# Altium schematic sheet Powersupply.SchDoc: 48v to 4v, 260mA
size A4; Organization: Altium Limited; Address1: L3, 12a Rodborough Rd; Address2: Frenchs Forest; Address3: NSW; Address4: Australia 2086; DocumentNumber: 1; Revision: 0; SheetNumber: 1; SheetTotal: 1
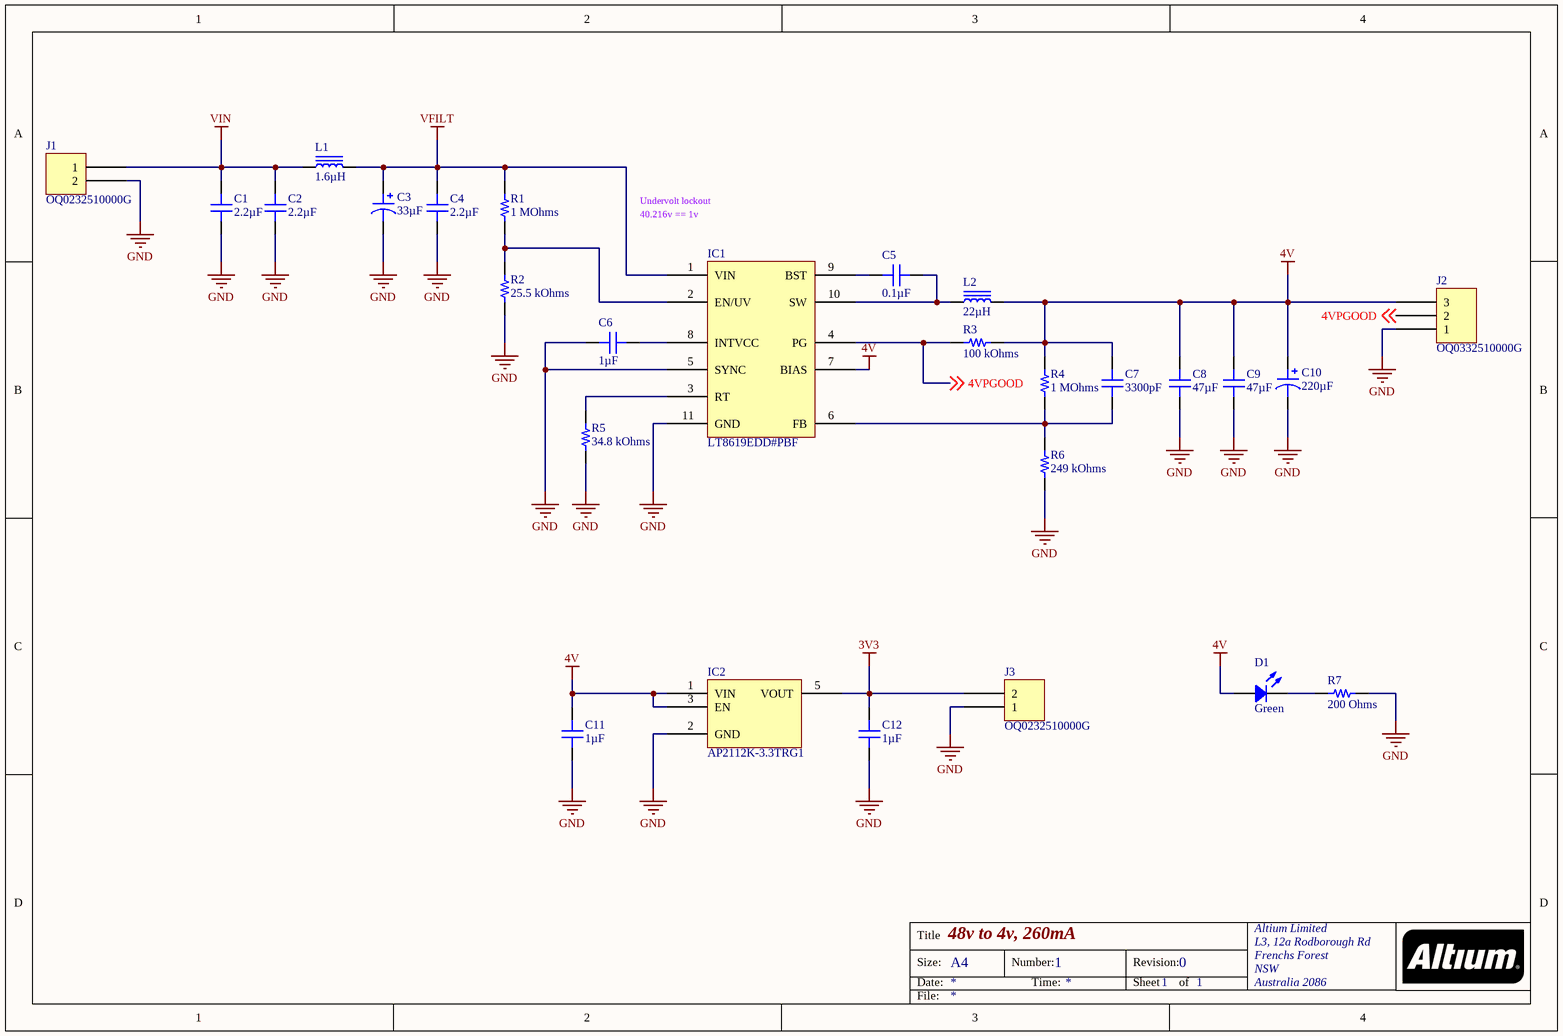
[diagram p0: Powersupply.SchDoc]

## Parts
C1  2.2µF  [CAP 1206_3216 - 1.8MM]
C2  2.2µF  [CAP 1206_3216 - 1.8MM]
C3  33µF  [CAP ALSMD 8.3MM H10.5MM]
C4  2.2µF  [CAP 1206_3216 - 1.8MM]
C5  0.1µF  [CAP 0603_1608]
C6  1µF  [CAP 0402_1005]
C7  3300pF  [CAP 0402_1005]
C8  47µF  [CAP 1206_3216 - 1.8MM]
C9  47µF  [CAP 1206_3216 - 1.8MM]
C10  220µF  [CAP ALSMD POLY 8.3MM H6.7MM]
C11  1µF  [CAP 0402_1005]
C12  1µF  [CAP 0402_1005]
D1  Green  [LED 0603_1608 GREEN]
IC1  LT8619EDD#PBF  [ANALOG DFN-10 3x3MM DD]
IC2  AP2112K-3.3TRG1  [DIODES SOT-23-5 W5]
J1  OQ0232510000G  [FCI 06-381-2PIN]
J2  OQ0332510000G  [FCI 06-381-3PIN]
J3  OQ0232510000G  [FCI 06-381-2PIN]
L1  1.6µH  [TDK VLCF4024-2]
L2  22µH  [TDK SLF12555]
R1  1 MOhms  [RES 0402_1005]
R2  25.5 kOhms  [RES 0402_1005]
R3  100 kOhms  [RES 0402_1005]
R4  1 MOhms  [RES 0402_1005]
R5  34.8 kOhms  [RES 0402_1005]
R6  249 kOhms  [RES 0402_1005]
R7  200 Ohms  [RES 0603_1608]

## Nets
3V3: C12.1 IC2.5(VOUT) J3.2
4V: C7.2 C8.2 C9.2 C10.1 C11.1 D1.1 IC1.7(BIAS) IC2.1(VIN) IC2.3(EN) J2.3 L2.2 R3.2 R4.2
GND: C1.1 C2.1 C3.2 C4.1 C6.2 C8.1 C9.1 C10.2 C11.2 C12.2 IC1.5(SYNC) IC1.11(GND) IC2.2(GND) J1.2 J2.1 J3.1 R2.1 R5.1 R6.1 R7.2
VFILT: C3.1 C4.2 IC1.1(VIN) L1.2 R1.2
VIN: C1.2 C2.2 J1.1 L1.1
4VPGOOD: IC1.4(PG) J2.2 R3.1 ; off-sheet 4VPGOOD
NetC5_1: C5.1 IC1.9(BST)
NetC5_2: C5.2 IC1.10(SW) L2.1
NetC6_1: C6.1 IC1.8(INTVCC)
NetC7_1: C7.1 IC1.6(FB) R4.1 R6.2
NetD1_2: D1.2 R7.1
NetIC1_2: IC1.2(EN/UV) R1.1 R2.2
NetIC1_3: IC1.3(RT) R5.2

## Notes on the sheet
- 40.216v == 1v
- Undervolt lockout
- Title
- Size:
- Date:
- A4
- Number:
- Time:
- Revision:
- Sheet
- of
- File:

## Library data of the parts
C1 C2 C4 = 12061C225KAT2A: CAP CER 2.2UF 100V X7R 1206; Manufacturer: AVX Corporation; Tolerance: ±10%; Part Number: 12061C225KAT2A; Value: 2.2µF; Applications: General Purpose; Capacitance: 2.2µF; ComponentLink1Description: Datasheet; ComponentLink1URL: http://datasheets.avx.com/X7RDielectric.pdf; ComponentLink2Description: DigiKey Link; ComponentLink2URL: //digikey.com/product-detail/en/avx-corporation/12061C225KAT2A/478-10860-2-ND/3081499; Device Package: 1206 (3216 Metric); LastUpdated: 29/11/2019 21:36:25; Lifecycle Status: 0; Minimum Order: 1; Mounting Type: Surface Mount, MLCC; Operating Temperature: -55°C ~ 125°C; Package / Case: 1206 (3216 Metric); Packaging: TapeAndReel; PartId: 22821; Part Status: Active; Price: 0.13; Series: -; Size / Dimension: 0.126" L x 0.063" W (3.20mm x 1.60mm); Supplier 1: DigiKey; Supplier Part Number 1: 478-10860-2-ND; Temperature Coefficient: X7R; Thickness (Max): 0.071" (1.80mm); Voltage - Rated: 100V
C3 = EEH-ZA1J330P: CAP ALUM POLY HYB 33UF 63V SMD; Manufacturer: Panasonic Electronic Components; ESR (Equivalent Series Resistance): 40mOhm; Lifetime @ Temp.: 10000 Hrs @ 105°C; Ripple Current @ High Frequency: 1.7A @ 100kHz; Ripple Current @ Low Frequency: 170mA @ 100Hz; Surface Mount Land Size: 0.327" L x 0.327" W (8.30mm x 8.30mm); Tolerance: ±20%; Type: Hybrid; Part Number: EEH-ZA1J330P; Applications: Automotive; Capacitance: 33µF; ComponentLink1Description: Datasheet; ComponentLink1URL: https://industrial.panasonic.com/cdbs/www-data/pdf/RDD0000/ABA0000C1221.pdf; ComponentLink2Description: DigiKey Link; ComponentLink2URL: //digikey.com/product-detail/en/panasonic-electronic-components/EEH-ZA1J330P/P15448TR-ND/3088131; Device Package: Radial, Can - SMD; Height - Seated (Max): 0.413" (10.50mm); LastUpdated: 22/12/2019 06:14:41; Lifecycle Status: 0; Minimum Order: 1; Mounting Type: Surface Mount; Operating Temperature: -55°C ~ 105°C; Package / Case: Radial, Can - SMD; Packaging: TapeAndReel; PartId: 2088; Part Status: Active; Price: 1.05; Ratings: AEC-Q200; Series: ZA; Size / Dimension: 0.315" Dia (8.00mm); Supplier 1: DigiKey; Supplier Part Number 1: P15448TR-ND; Value: 33µF; Voltage - Rated: 63V
C5 = HMK107B7104MA-T: CAP CER 0.1UF 100V X7R 0603; Manufacturer: Taiyo Yuden; Tolerance: ±20%; Part Number: HMK107B7104MA-T; Value: 0.1µF; Applications: General Purpose; Capacitance: 0.1µF; ComponentLink1Description: Datasheet; ComponentLink1URL: https://ds.yuden.co.jp/TYCOMPAS/ut/detail?pn=HMK107B7104MA-T &u=M; ComponentLink2Description: DigiKey Link; ComponentLink2URL: //digikey.com/product-detail/en/taiyo-yuden/HMK107B7104MA-T/587-6323-2-ND/5810933; Device Package: 0603 (1608 Metric); Features: High Voltage; LastUpdated: 29/11/2019 20:59:48; Lifecycle Status: 0; Minimum Order: 1; Mounting Type: Surface Mount, MLCC; Operating Temperature: -55°C ~ 125°C; Package / Case: 0603 (1608 Metric); Packaging: TapeAndReel; PartId: 4530; Part Status: Active; Price: 0.02; Series: M; Size / Dimension: 0.063" L x 0.031" W (1.60mm x 0.80mm); Supplier 1: DigiKey; Supplier Part Number 1: 587-6323-2-ND; Temperature Coefficient: X7R; Thickness (Max): 0.035" (0.90mm); Voltage - Rated: 100V
C6 C11 C12 = LMK105C6105MV-F: CAP CER 1UF 10V X6S 0402; Manufacturer: Taiyo Yuden; Tolerance: ±20%; Part Number: LMK105C6105MV-F; Value: 1µF; Applications: SMPS Filtering; Capacitance: 1µF; ComponentLink1Description: Datasheet; ComponentLink1URL: https://ds.yuden.co.jp/TYCOMPAS/ut/detail?pn=LMK105C6105MV-F &u=M; ComponentLink2Description: DigiKey Link; ComponentLink2URL: //digikey.com/product-detail/en/taiyo-yuden/LMK105C6105MV-F/587-5462-2-ND/7067047; Device Package: 0402 (1005 Metric); LastUpdated: 29/11/2019 20:59:56; Lifecycle Status: 0; Minimum Order: 1; Mounting Type: Surface Mount, MLCC; Operating Temperature: -55°C ~ 105°C; Package / Case: 0402 (1005 Metric); Packaging: TapeAndReel; PartId: 9523; Part Status: Active; Price: 0.01; Series: M; Size / Dimension: 0.039" L x 0.020" W (1.00mm x 0.50mm); Supplier 1: DigiKey; Supplier Part Number 1: 587-5462-2-ND; Temperature Coefficient: X6S; Thickness (Max): 0.022" (0.55mm); Voltage - Rated: 10V
C7 = CC0402KRX7R9BB332: CAP CER 3300PF 50V X7R 0402; Manufacturer: Yageo; Tolerance: ±10%; Part Number: CC0402KRX7R9BB332; Value: 3300pF; Applications: General Purpose; Capacitance: 3300pF; ComponentLink1Description: Datasheet; ComponentLink1URL: https://www.yageo.com/upload/media/product/productsearch/datasheet/mlcc/UPY-GPHC_X7R_6.3V-to-50V_18.pdf; ComponentLink2Description: DigiKey Link; ComponentLink2URL: //digikey.com/product-detail/en/yageo/CC0402KRX7R9BB332/311-1034-2-ND/302768; Device Package: 0402 (1005 Metric); LastUpdated: 29/11/2019 20:59:48; Lifecycle Status: 0; Minimum Order: 1; Mounting Type: Surface Mount, MLCC; Operating Temperature: -55°C ~ 125°C; Package / Case: 0402 (1005 Metric); Packaging: TapeAndReel; PartId: 4849; Part Status: Active; Price: 0.00; Series: CC; Size / Dimension: 0.039" L x 0.020" W (1.00mm x 0.50mm); Supplier 1: DigiKey; Supplier Part Number 1: 311-1034-2-ND; Temperature Coefficient: X7R; Thickness (Max): 0.022" (0.55mm); Voltage - Rated: 50V
C8 C9 = LMK316BJ476ML-T: CAP CER 47UF 10V X5R 1206; Manufacturer: Taiyo Yuden; Tolerance: ±20%; Part Number: LMK316BJ476ML-T; Value: 47µF; Applications: General Purpose; Capacitance: 47µF; ComponentLink1Description: Datasheet; ComponentLink1URL: https://www.yuden.co.jp/productdata/catalog/mlcc01_e.pdf; ComponentLink2Description: DigiKey Link; ComponentLink2URL: //digikey.com/product-detail/en/taiyo-yuden/LMK316BJ476ML-T/587-1780-2-ND/1212780; Device Package: 1206 (3216 Metric); LastUpdated: 29/11/2019 21:36:20; Lifecycle Status: 0; Minimum Order: 1; Mounting Type: Surface Mount, MLCC; Operating Temperature: -55°C ~ 85°C; Package / Case: 1206 (3216 Metric); Packaging: TapeAndReel; PartId: 22184; Part Status: Active; Price: 0.15; Series: M; Size / Dimension: 0.126" L x 0.063" W (3.20mm x 1.60mm); Supplier 1: DigiKey; Supplier Part Number 1: 587-1780-2-ND; Temperature Coefficient: X5R; Thickness (Max): 0.071" (1.80mm); Voltage - Rated: 10V
C10 = APXA6R3ARA221MH70G: CAP ALUM POLY 220UF 20% 6.3V SMD; Manufacturer: United Chemi-Con; ESR (Equivalent Series Resistance): 25mOhm; Lifetime @ Temp.: 15000 Hrs @ 105°C; Ripple Current @ High Frequency: 3.02A @ 100kHz; Surface Mount Land Size: 0.327" L x 0.327" W (8.30mm x 8.30mm); Type: Polymer; Part Number: APXA6R3ARA221MH70G; Applications: General Purpose; Capacitance: 220µF; ComponentLink1Description: Datasheet; ComponentLink1URL: http://www.chemi-con.co.jp/cgi-bin/CAT_DB/SEARCH/cat_db_al.cgi?e=e&j=p&pdfname=pxa; ComponentLink2Description: DigiKey Link; ComponentLink2URL: //digikey.com/product-detail/en/united-chemi-con/APXA6R3ARA221MH70G/565-3114-2-ND/758544; Device Package: Radial, Can - SMD; Height - Seated (Max): 0.264" (6.70mm); LastUpdated: 22/12/2019 07:43:13; Lifecycle Status: 0; Minimum Order: 1; Mounting Type: Surface Mount; Operating Temperature: -55°C ~ 105°C; Package / Case: Radial, Can - SMD; Packaging: TapeAndReel; PartId: 2343; Part Status: Active; Price: 0.58; Series: NPCAP™-PXA; Size / Dimension: 0.315" Dia (8.00mm); Supplier 1: DigiKey; Supplier Part Number 1: 565-3114-2-ND; Tolerance: ±20%; Value: 220µF; Voltage - Rated: 6.3V
D1 = LTST-C191KGKT: LED GREEN CLEAR SMD; Manufacturer: Lite-On Inc.; Configuration: Standard; Current - Test: 20mA; Lens Color: Colorless; Lens Size: 1.10mm x 0.80mm; Lens Style: Rectangle with Flat Top; Millicandela Rating: 35mcd; Viewing Angle: 130°; Voltage - Forward (Vf) (Typ): 2V; Wavelength - Dominant: 571nm; Wavelength - Peak: 574nm; Part Number: LTST-C191KGKT; Color: Green; ComponentLink1Description: Datasheet; ComponentLink1URL: http://optoelectronics.liteon.com/upload/download/DS22-2000-228/LTST-C191KGKT.PDF; ComponentLink2Description: DigiKey Link; ComponentLink2URL: //digikey.com/product-detail/en/lite-on-inc/LTST-C191KGKT/160-1446-2-ND/386835; Device Package: 0603 (1608 Metric); Height (Max): 0.65mm; LastUpdated: 01/12/2019 14:50:11; Lens Transparency: Clear; Lifecycle Status: 0; Minimum Order: 1; Mounting Type: Surface Mount; Package / Case: 0603 (1608 Metric); Packaging: TapeAndReel; PartId: 655; Part Status: Active; Price: 0.04; Series: -; Size / Dimension: 1.60mm L x 0.80mm W; Supplier 1: DigiKey; Supplier Part Number 1: 160-1446-2-ND; Value: Green
IC1 = LT8619EDD#PBF: IC REG BUCK 0.8V 1.2A 10DFN; Manufacturer: Linear Technology/Analog Devices; Frequency - Switching: 300kHz ~ 2.2MHz; Function: Step-Down; Number of Outputs: 1; Output Configuration: Positive; Output Type: Fixed; Synchronous Rectifier: Yes; Voltage - Input (Max): 60V; Voltage - Input (Min): 3V; Voltage - Output (Max): 59.4V; Part Number: LT8619EDD#PBF; ComponentLink1Description: Datasheet; ComponentLink1URL: http://www.analog.com/media/en/technical-documentation/data-sheets/LT8619-8619-5.pdf; ComponentLink2Description: DigiKey Link; ComponentLink2URL: //digikey.com/product-detail/en/linear-technology-analog-devices/LT8619EDD-PBF/LT8619EDD-PBF-ND/8275876; Current - Output: 1.2A; Device Package: 10-WFDFN Exposed Pad; LastUpdated: 22/12/2019 05:56:33; Lifecycle Status: 0; Minimum Order: 1; Mounting Type: Surface Mount; Operating Temperature: 0°C ~ 125°C (TJ); Package / Case: 10-WFDFN Exposed Pad; Packaging: Tube; Part Status: Active; Price: 6.43; Series: -; Supplier 1: DigiKey; Supplier Part Number 1: LT8619EDD#PBF-ND; Supplier Device Package: 10-DFN (3x3); Topology: Buck; Voltage - Output (Min/Fixed): 0.8V
IC2 = AP2112K-3.3TRG1: IC REG LINEAR 3.3V 600MA SOT25; Manufacturer: Diodes Incorporated; Control Features: Enable; Current - Quiescent (Iq): 80µA; Number of Regulators: 1; Output Configuration: Positive; Output Type: Fixed; Protection Features: Over Current, Over Temperature; PSRR: 65sB (100Hz ~ 1KHz); Voltage Dropout (Max): 0.4V @ 600mA; Voltage - Input (Max): 6V; Part Number: AP2112K-3.3TRG1; ComponentLink1Description: Datasheet; ComponentLink1URL: https://www.diodes.com/assets/Datasheets/AP2112.pdf; ComponentLink2Description: DigiKey Link; ComponentLink2URL: //digikey.com/product-detail/en/diodes-incorporated/AP2112K-3.3TRG1/AP2112K-3.3TRG1DITR-ND/4470746; Current - Output: 600mA; Device Package: SC-74A, SOT-753; LastUpdated: 22/12/2019 09:57:18; Lifecycle Status: 0; Minimum Order: 1; Mounting Type: Surface Mount; Operating Temperature: -40°C ~ 85°C; Package / Case: SC-74A, SOT-753; Packaging: TapeAndReel; Part Status: Active; Price: 0.10; Series: -; Supplier 1: DigiKey; Supplier Part Number 1: AP2112K-3.3TRG1DITR-ND; Supplier Device Package: SOT-25; Voltage - Output (Min/Fixed): 3.3V
J1 J3 = OQ0232510000G: TERM BLOCK HDR 2POS 90DEG 3.81MM; Manufacturer: Amphenol Anytek; Current - UL: 10A; Header Orientation: 90°, Right Angle; Number of Levels: 1; Number of Positions: 2; Pitch: 0.150" (3.81mm); Voltage - UL: 300V; Color: Green; ComponentLink1Description: Datasheet; ComponentLink1URL: http://portal.fciconnect.com/Comergent//fci/drawing/oqxx32x100j0g.pdf; ComponentLink2Description: DigiKey Link; ComponentLink2URL: //digikey.com/product-detail/en/amphenol-anytek/OQ0232510000G/609-3819-ND/2261255; Contact Mating Finish: Tin; LastUpdated: 16/12/2019 19:14:30; Lifecycle Status: 0; Part Number: OQ0232510000G; Minimum Order: 1; Mounting Type: Through Hole; Operating Temperature: -40°C ~ 115°C; Packaging: Bulk; Part Status: Active; Positions Per Level: 2; Price: 0.49; Series: 06-381; Supplier 1: DigiKey; Supplier Part Number 1: 609-3819-ND; Termination Style: Solder; Type: Header, Male Pins, Shrouded (4 Side)
J2 = OQ0332510000G: TERM BLOCK HDR 3POS 90DEG 3.81MM; Manufacturer: Amphenol Anytek; Current - UL: 10A; Header Orientation: 90°, Right Angle; Number of Levels: 1; Number of Positions: 3; Pitch: 0.150" (3.81mm); Voltage - UL: 300V; Color: Green; ComponentLink1Description: Datasheet; ComponentLink1URL: http://portal.fciconnect.com/Comergent//fci/drawing/oqxx32x100j0g.pdf; ComponentLink2Description: DigiKey Link; ComponentLink2URL: //digikey.com/product-detail/en/amphenol-anytek/OQ0332510000G/609-3820-ND/2261261; Contact Mating Finish: Tin; LastUpdated: 16/12/2019 19:14:46; Lifecycle Status: 0; Part Number: OQ0332510000G; Minimum Order: 1; Mounting Type: Through Hole; Operating Temperature: -40°C ~ 115°C; Packaging: Bulk; Part Status: Active; Positions Per Level: 3; Price: 0.53; Series: 06-381; Supplier 1: DigiKey; Supplier Part Number 1: 609-3820-ND; Termination Style: Solder; Type: Header, Male Pins, Shrouded (4 Side)
L1 = VLCF4024T-1R6N2R1-2: FIXED IND 1.6UH 2.1A 39 MOHM SMD; Manufacturer: TDK Corporation; DC Resistance (DCR): 39mOhm Max; Inductance Frequency - Test: 100kHz; Material - Core: Ferrite; Shielding: Shielded; Tolerance: ±30%; Type: Wirewound; Part Number: VLCF4024T-1R6N2R1-2; ComponentLink1Description: Datasheet; ComponentLink1URL: https://product.tdk.com/info/en/catalog/datasheets/inductor_commercial_power_vlcf4024-2_en.pdf?ref_disty=digikey; ComponentLink2Description: DigiKey Link; ComponentLink2URL: //digikey.com/product-detail/en/tdk-corporation/VLCF4024T-1R6N2R1-2/445-8731-2-ND/3083276; Current Rating (Amps): 2.1A; Current - Saturation: 2.1A; Device Package: Nonstandard; Height - Seated (Max): 0.094" (2.40mm); Inductance: 1.6µH; LastUpdated: 02/12/2019 13:29:53; Lifecycle Status: 0; Minimum Order: 1; Mounting Type: Surface Mount; Operating Temperature: -40°C ~ 105°C; Package / Case: Nonstandard; Packaging: TapeAndReel; PartId: 156; Part Status: Active; Price: 0.44; Series: VLCF; Size / Dimension: 0.157" L x 0.157" W (4.00mm x 4.00mm); Supplier 1: DigiKey; Supplier Part Number 1: 445-8731-2-ND; Value: 1.6µH
L2 = SLF12555T-220M2R3-PF: FIXED IND 22UH 2.3A 33.8 MOHM; Manufacturer: TDK Corporation; Current Rating (Amps): 3.4A; Inductance Frequency - Test: 1kHz; Material - Core: Ferrite; Shielding: Shielded; Tolerance: ±20%; Type: Wirewound; Part Number: SLF12555T-220M2R3-PF; ComponentLink1Description: Datasheet; ComponentLink1URL: https://product.tdk.com/info/en/catalog/datasheets/inductor_commercial_power_slf12555_en.pdf?ref_disty=digikey; ComponentLink2Description: DigiKey Link; ComponentLink2URL: http://digikey.com/product-detail/en/tdk-corporation/SLF12555T-220M2R3-PF/445-174225-1-ND/5823095; Current - Saturation: 2.3A; DC Resistance (DCR): 33.8mOhm; Device Package: Nonstandard; Height - Seated (Max): 0.228" (5.80mm); Inductance: 22µH; LastUpdated: 02/01/2020 00:15:33; Lifecycle Status: Active; Minimum Order: 1; Mounting Type: Surface Mount; Operating Temperature: -40°C ~ 105°C; Package / Case: Nonstandard; Packaging: ReReel; PartId: 110; Part Status: Active; Price: 0.00; Series: SLF; Size / Dimension: 0.492" L x 0.492" W (12.50mm x 12.50mm); Supplier 1: DigiKey; Supplier Part Number 1: 445-174225-1-ND; Value: 22µH
R1 R4 = ERJ-2RKF1004X: RES SMD 1M OHM 1% 1/10W 0402; Manufacturer: Panasonic Electronic Components; Power (Watts): 0.1W, 1/10W; Temperature Coefficient: ±100ppm/°C; Part Number: ERJ-2RKF1004X; Value: 1 MOhms; ComponentLink1Description: Datasheet; ComponentLink1URL: https://industrial.panasonic.com/cdbs/www-data/pdf/RDA0000/AOA0000C304.pdf; ComponentLink2Description: DigiKey Link; ComponentLink2URL: //digikey.com/product-detail/en/panasonic-electronic-components/ERJ-2RKF1004X/P1.00MLTR-ND/79728; Composition: Thick Film; Device Package: 0402 (1005 Metric); Features: Automotive AEC-Q200; Height - Seated (Max): 0.016" (0.40mm); LastUpdated: 29/11/2019 21:01:28; Lifecycle Status: 0; Minimum Order: 1; Number of Terminations: 2; Operating Temperature: -55°C ~ 155°C; Package / Case: 0402 (1005 Metric); Packaging: TapeAndReel; PartId: 19614; Part Status: Active; Price: 0.00; Ratings: AEC-Q200; Resistance: 1 MOhms; Series: ERJ; Size / Dimension: 0.039" L x 0.020" W (1.00mm x 0.50mm); Supplier 1: DigiKey; Supplier Part Number 1: P1.00MLTR-ND; Supplier Device Package: 0402; Tolerance: ±1%
R2 = ERJ-2RKF2552X: RES SMD 25.5K OHM 1% 1/10W 0402; Manufacturer: Panasonic Electronic Components; Power (Watts): 0.1W, 1/10W; Temperature Coefficient: ±100ppm/°C; Part Number: ERJ-2RKF2552X; Value: 25.5 kOhms; ComponentLink1Description: Datasheet; ComponentLink1URL: https://industrial.panasonic.com/cdbs/www-data/pdf/RDA0000/AOA0000C304.pdf; ComponentLink2Description: DigiKey Link; ComponentLink2URL: //digikey.com/product-detail/en/panasonic-electronic-components/ERJ-2RKF2552X/P25.5KLTR-ND/192251; Composition: Thick Film; Device Package: 0402 (1005 Metric); Features: Automotive AEC-Q200; Height - Seated (Max): 0.016" (0.40mm); LastUpdated: 29/11/2019 21:01:33; Lifecycle Status: 0; Minimum Order: 1; Number of Terminations: 2; Operating Temperature: -55°C ~ 155°C; Package / Case: 0402 (1005 Metric); Packaging: TapeAndReel; PartId: 21268; Part Status: Active; Price: 0.00; Ratings: AEC-Q200; Resistance: 25.5 kOhms; Series: ERJ; Size / Dimension: 0.039" L x 0.020" W (1.00mm x 0.50mm); Supplier 1: DigiKey; Supplier Part Number 1: P25.5KLTR-ND; Supplier Device Package: 0402; Tolerance: ±1%
R3 = CRG0402F100K: RES SMD 100K OHM 1% 1/16W 0402; Manufacturer: TE Connectivity Passive Product; Power (Watts): 0.063W, 1/16W; Temperature Coefficient: ±100ppm/°C; Part Number: CRG0402F100K; Value: 100 kOhms; ComponentLink1Description: Datasheet; ComponentLink1URL: https://www.te.com/commerce/DocumentDelivery/DDEController?Action=srchrtrv&DocNm=1773204&DocType=DS&DocLang=English; ComponentLink2Description: DigiKey Link; ComponentLink2URL: //digikey.com/product-detail/en/te-connectivity-passive-product/CRG0402F100K/A121526TR-ND/2390483; Composition: Thick Film; Device Package: 0402 (1005 Metric); Height - Seated (Max): 0.016" (0.40mm); LastUpdated: 29/11/2019 21:01:32; Lifecycle Status: 0; Minimum Order: 1; Number of Terminations: 2; Operating Temperature: -55°C ~ 155°C; Package / Case: 0402 (1005 Metric); Packaging: TapeAndReel; PartId: 20715; Part Status: Active; Price: 0.00; Resistance: 100 kOhms; Series: CRG, Neohm; Size / Dimension: 0.039" L x 0.020" W (1.00mm x 0.50mm); Supplier 1: DigiKey; Supplier Part Number 1: A121526TR-ND; Supplier Device Package: 0402; Tolerance: ±1%
R5 = ERJ-2RKF3482X: RES SMD 34.8K OHM 1% 1/10W 0402; Manufacturer: Panasonic Electronic Components; Power (Watts): 0.1W, 1/10W; Temperature Coefficient: ±100ppm/°C; Part Number: ERJ-2RKF3482X; Value: 34.8 kOhms; ComponentLink1Description: Datasheet; ComponentLink1URL: https://industrial.panasonic.com/cdbs/www-data/pdf/RDA0000/AOA0000C304.pdf; ComponentLink2Description: DigiKey Link; ComponentLink2URL: //digikey.com/product-detail/en/panasonic-electronic-components/ERJ-2RKF3482X/P34.8KLTR-ND/192312; Composition: Thick Film; Device Package: 0402 (1005 Metric); Features: Automotive AEC-Q200; Height - Seated (Max): 0.016" (0.40mm); LastUpdated: 29/11/2019 21:00:35; Lifecycle Status: 0; Minimum Order: 1; Number of Terminations: 2; Operating Temperature: -55°C ~ 155°C; Package / Case: 0402 (1005 Metric); Packaging: TapeAndReel; PartId: 3767; Part Status: Active; Price: 0.00; Ratings: AEC-Q200; Resistance: 34.8 kOhms; Series: ERJ; Size / Dimension: 0.039" L x 0.020" W (1.00mm x 0.50mm); Supplier 1: DigiKey; Supplier Part Number 1: P34.8KLTR-ND; Supplier Device Package: 0402; Tolerance: ±1%
R6 = ERJ-2RKF2493X: RES SMD 249K OHM 1% 1/10W 0402; Manufacturer: Panasonic Electronic Components; Power (Watts): 0.1W, 1/10W; Temperature Coefficient: ±100ppm/°C; Part Number: ERJ-2RKF2493X; Value: 249 kOhms; ComponentLink1Description: Datasheet; ComponentLink1URL: https://industrial.panasonic.com/cdbs/www-data/pdf/RDA0000/AOA0000C304.pdf; ComponentLink2Description: DigiKey Link; ComponentLink2URL: //digikey.com/product-detail/en/panasonic-electronic-components/ERJ-2RKF2493X/P249KLTR-ND/192249; Composition: Thick Film; Device Package: 0402 (1005 Metric); Features: Automotive AEC-Q200; Height - Seated (Max): 0.016" (0.40mm); LastUpdated: 29/11/2019 21:01:34; Lifecycle Status: 0; Minimum Order: 1; Number of Terminations: 2; Operating Temperature: -55°C ~ 155°C; Package / Case: 0402 (1005 Metric); Packaging: TapeAndReel; PartId: 21288; Part Status: Active; Price: 0.00; Ratings: AEC-Q200; Resistance: 249 kOhms; Series: ERJ; Size / Dimension: 0.039" L x 0.020" W (1.00mm x 0.50mm); Supplier 1: DigiKey; Supplier Part Number 1: P249KLTR-ND; Supplier Device Package: 0402; Tolerance: ±1%
R7 = ERJ-3GEYJ201V: RES SMD 200 OHM 5% 1/10W 0603; Manufacturer: Panasonic Electronic Components; Power (Watts): 0.1W, 1/10W; Temperature Coefficient: ±200ppm/°C; Part Number: ERJ-3GEYJ201V; Value: 200 Ohms; ComponentLink1Description: Datasheet; ComponentLink1URL: http://industrial.panasonic.com/www-cgi/jvcr13pz.cgi?E+PZ+3+AOA0001+ERJ3GEYJ201V+7+WW; ComponentLink2Description: DigiKey Link; ComponentLink2URL: //digikey.com/product-detail/en/panasonic-electronic-components/ERJ-3GEYJ201V/P200GTR-ND/135708; Composition: Thick Film; Device Package: 0603 (1608 Metric); Features: Automotive AEC-Q200; Height - Seated (Max): 0.022" (0.55mm); LastUpdated: 29/11/2019 21:01:23; Lifecycle Status: 0; Minimum Order: 1; Number of Terminations: 2; Operating Temperature: -55°C ~ 155°C; Package / Case: 0603 (1608 Metric); Packaging: TapeAndReel; PartId: 18352; Part Status: Active; Price: 0.00; Ratings: AEC-Q200; Resistance: 200 Ohms; Series: ERJ; Size / Dimension: 0.063" L x 0.031" W (1.60mm x 0.80mm); Supplier 1: DigiKey; Supplier Part Number 1: P200GTR-ND; Supplier Device Package: 0603; Tolerance: ±5%